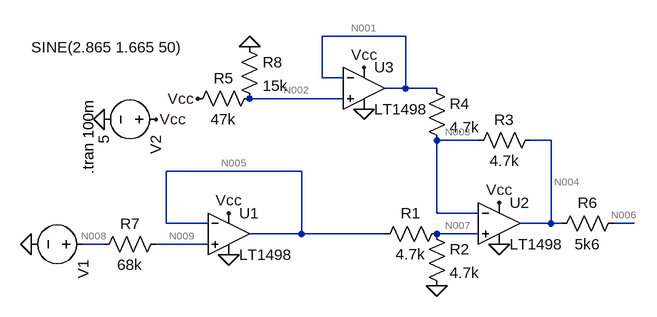
[diagram p0: schematic iot-projekti-wind-direction.asc]
iot-projekti-wind-direction.asc, the LTspice schematic file:
Version 4
SHEET 1 880 680
WIRE 288 -144 160 -144
WIRE 160 -80 160 -144
WIRE 192 -80 160 -80
WIRE 288 -64 288 -144
WIRE 288 -64 256 -64
WIRE 336 -64 288 -64
WIRE 192 -48 48 -48
WIRE 400 16 336 16
WIRE 512 16 480 16
WIRE 128 64 -80 64
WIRE 336 128 336 16
WIRE 400 128 336 128
WIRE -80 144 -80 64
WIRE -16 144 -80 144
WIRE 512 144 512 16
WIRE 512 144 464 144
WIRE 528 144 512 144
WIRE 640 144 608 144
WIRE 128 160 128 64
WIRE 128 160 48 160
WIRE 256 160 128 160
WIRE 400 160 336 160
WIRE -176 176 -208 176
WIRE -16 176 -96 176
FLAG -288 176 0
FLAG -176 -16 0
FLAG 16 192 0
FLAG -96 -16 Vcc
FLAG 16 128 Vcc
FLAG 432 176 0
FLAG 432 112 Vcc
FLAG 336 240 0
FLAG -32 -48 Vcc
FLAG 48 -128 0
FLAG 224 -32 0
FLAG 224 -96 Vcc
SYMBOL OpAmps\\LT1498 16 96 R0
SYMATTR InstName U1
SYMBOL voltage -192 176 R90
WINDOW 123 0 0 Left 0
WINDOW 39 0 0 Left 0
WINDOW 3 -303 -138 VRight 2
SYMATTR Value SINE(2.865 1.665 50)
SYMATTR InstName V1
SYMBOL voltage -80 -16 R90
WINDOW 123 0 0 Left 0
WINDOW 39 0 0 Left 0
SYMATTR InstName V2
SYMATTR Value 5
SYMBOL res 512 160 R270
WINDOW 0 32 56 VTop 2
WINDOW 3 0 56 VBottom 2
SYMATTR InstName R6
SYMATTR Value 5k6
SYMBOL res -192 192 R270
WINDOW 0 32 56 VTop 2
WINDOW 3 0 56 VBottom 2
SYMATTR InstName R7
SYMATTR Value 68k
SYMBOL OpAmps\\LT1498 432 80 R0
SYMATTR InstName U2
SYMBOL res 352 144 R90
WINDOW 0 0 56 VBottom 2
WINDOW 3 32 56 VTop 2
SYMATTR InstName R1
SYMATTR Value 4.7k
SYMBOL res 320 144 R0
SYMATTR InstName R2
SYMATTR Value 4.7k
SYMBOL res 496 0 R90
WINDOW 0 0 56 VBottom 2
WINDOW 3 32 56 VTop 2
SYMATTR InstName R3
SYMATTR Value 4.7k
SYMBOL res 320 -80 R0
SYMATTR InstName R4
SYMATTR Value 4.7k
SYMBOL res 64 -64 R90
WINDOW 0 0 56 VBottom 2
WINDOW 3 32 56 VTop 2
SYMATTR InstName R5
SYMATTR Value 47k
SYMBOL res 32 -144 R0
SYMATTR InstName R8
SYMATTR Value 15k
SYMBOL OpAmps\\LT1498 224 -128 R0
SYMATTR InstName U3
TEXT -200 -48 VRight 2 !.tran 100m

The netlist it stands for:
* iot-projekti-wind-direction.asc
XU1 N009 N005 Vcc 0 N005 LT1498  ; pins In+ In- V+ V- OUT
V1 N008 0 SINE(2.865 1.665 50)
V2 Vcc 0 5
R6 N004 N006 5k6
R7 N008 N009 68k
XU2 N007 N003 Vcc 0 N004 LT1498  ; pins In+ In- V+ V- OUT
R1 N007 N005 4.7k
R2 N007 0 4.7k
R3 N004 N003 4.7k
R4 N001 N003 4.7k
R5 N002 Vcc 47k
R8 0 N002 15k
XU3 N002 N001 Vcc 0 N001 LT1498  ; pins In+ In- V+ V- OUT
.tran 100m
.lib LTC.lib
.backanno
.end

* Results of the author's LTspice run, read from the files saved beside the schematic
* Operating Point, zero values left out:
*   V(n005) = 2.882 V
*   V(n009) = 2.882 V
*   V(vcc) = 5 V
*   V(n008) = 2.865 V
*   V(n004) = 1.669 V
*   V(n006) = 1.669 V
*   V(n003) = 1.442 V
*   V(n007) = 1.442 V
*   V(n001) = 1.213 V
*   V(n002) = 1.213 V
*   I(R7) = -249.2 nA
*   I(R1) = -306.5 µA
*   I(R2) = 306.7 µA
*   I(R3) = 48.47 µA
*   I(R4) = -48.73 µA
*   I(R5) = -80.58 µA
*   I(R8) = -80.84 µA
*   I(V1) = 249.2 nA
*   I(V2) = -5.329 mA
*   Ix(u1:1) = -249.2 nA
*   Ix(u1:2) = -249.2 nA
*   Ix(u1:3) = 1.847 mA
*   Ix(u1:4) = -1.54 mA
*   Ix(u1:5) = -306.2 µA
*   Ix(u2:1) = -252.2 nA
*   Ix(u2:2) = -252.2 nA
*   Ix(u2:3) = 1.723 mA
*   Ix(u2:4) = -1.674 mA
*   Ix(u2:5) = -48.47 µA
*   Ix(u3:1) = -252.7 nA
*   Ix(u3:2) = -252.7 nA
*   Ix(u3:3) = 1.678 mA
*   Ix(u3:4) = -1.727 mA
*   Ix(u3:5) = 48.98 µA
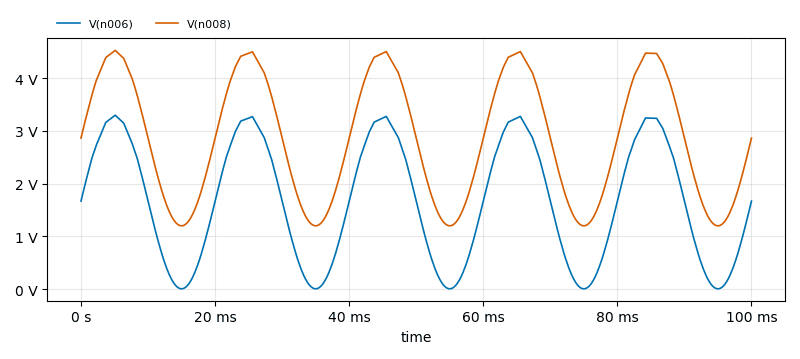
[diagram p1: Transient Analysis of iot-projekti-wind-direction.asc, plotted from the saved traces]
* Transient Analysis, 1 run:
*   V(n006): min 4.995 mV, max 3.299 V, average 1.651 V, rms 2.017 V, last 1.669 V
*   V(n008): min 1.2 V, max 4.529 V, average 2.858 V, rms 3.088 V, last 2.865 V